# EAGLE schematic PLT-01-RevC (EAGLE 7.6.0)
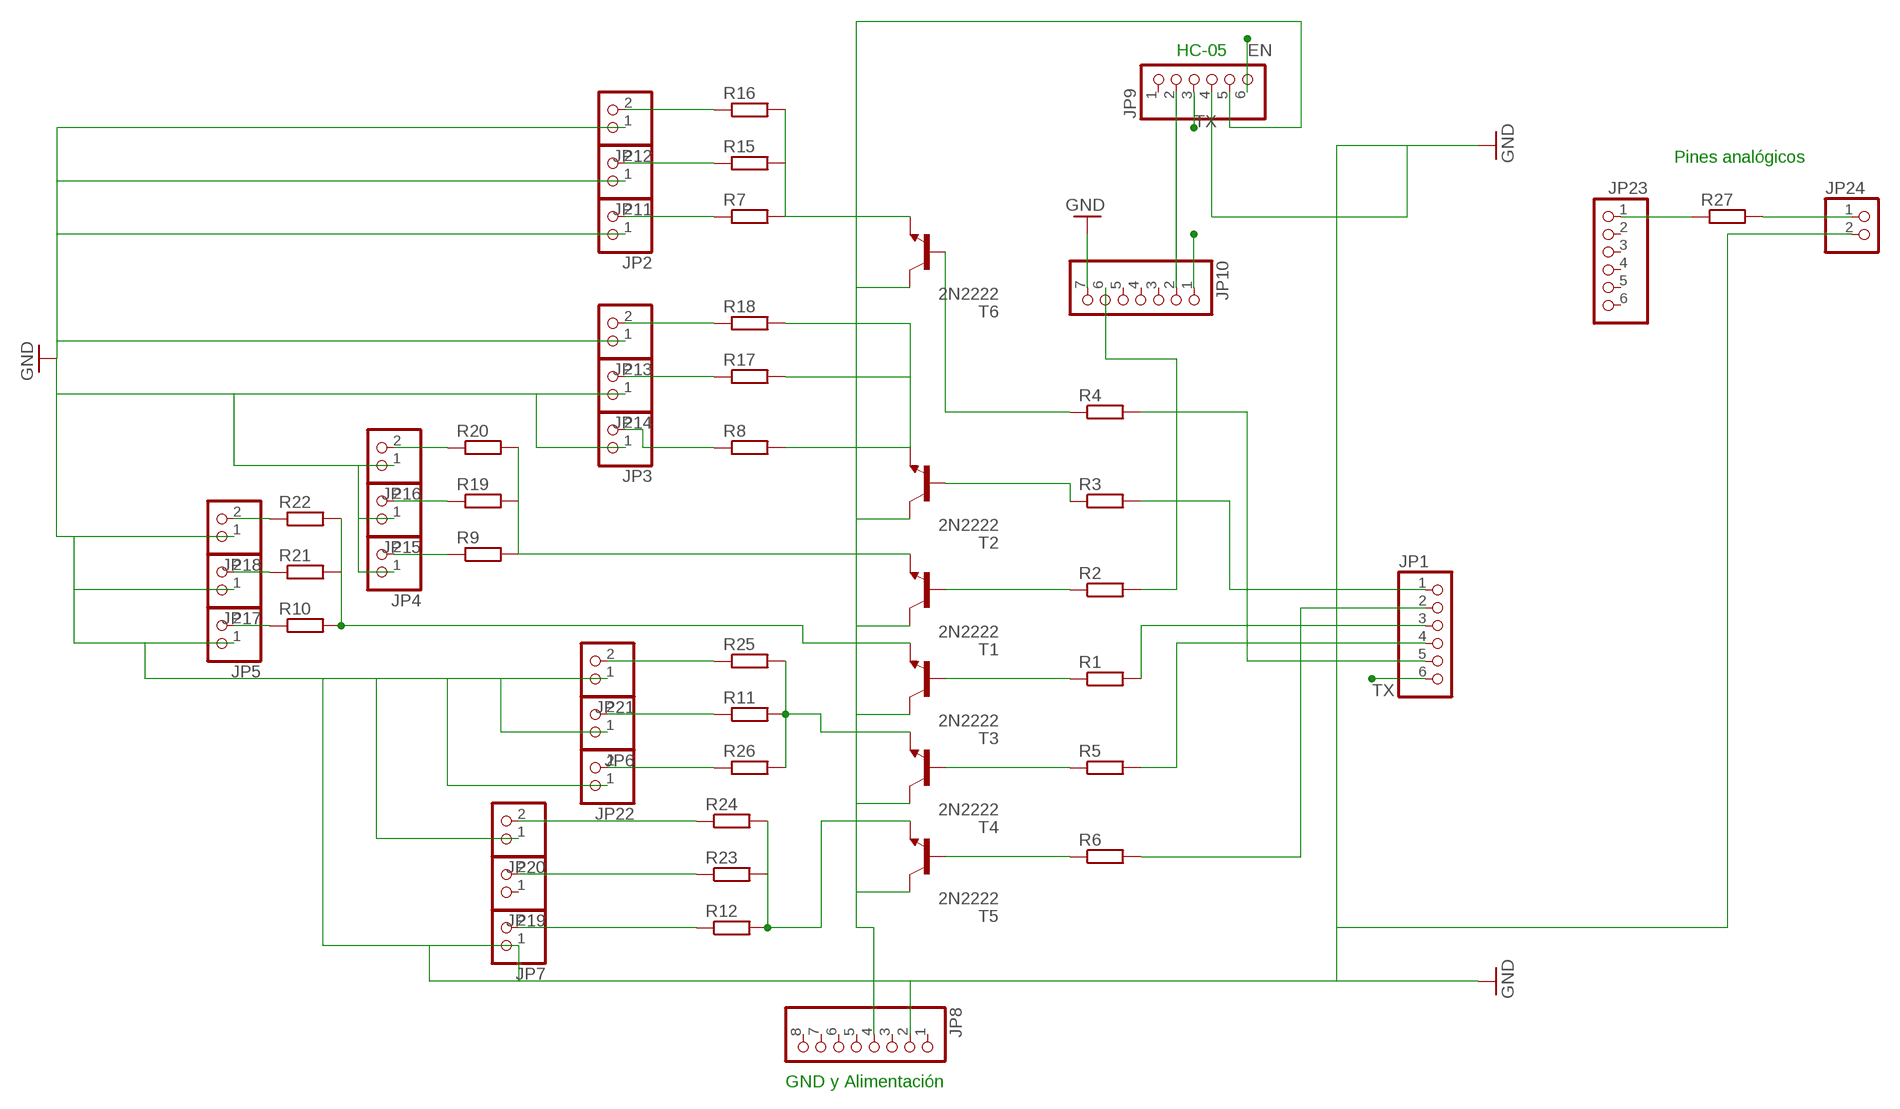
[diagram p0: schematic, sheet 1]

## Parts
JP1  PINHD-1X6  [1X06]
JP2  PINHD-1X2  [1X02]
JP3  PINHD-1X2  [1X02]
JP4  PINHD-1X2  [1X02]
JP5  PINHD-1X2  [1X02]
JP6  PINHD-1X2  [1X02]
JP7  PINHD-1X2  [1X02]
JP8  PINHD-1X8  [1X08]
JP9  PINHD-1X6  [1X06]
JP10  PINHD-1X7  [1X07]
JP11  PINHD-1X2  [1X02]
JP12  PINHD-1X2  [1X02]
JP13  PINHD-1X2  [1X02]
JP14  PINHD-1X2  [1X02]
JP15  PINHD-1X2  [1X02]
JP16  PINHD-1X2  [1X02]
JP17  PINHD-1X2  [1X02]
JP18  PINHD-1X2  [1X02]
JP19  PINHD-1X2  [1X02]
JP20  PINHD-1X2  [1X02]
JP21  PINHD-1X2  [1X02]
JP22  PINHD-1X2  [1X02]
JP23  PINHD-1X6  [1X06]
JP24  PINHD-1X2  [1X02]
R1  R-EU_0207/10  [0207/10]
R2  R-EU_0207/10  [0207/10]
R3  R-EU_0207/10  [0207/10]
R4  R-EU_0207/10  [0207/10]
R5  R-EU_0207/10  [0207/10]
R6  R-EU_0207/10  [0207/10]
R7  R-EU_0207/10  [0207/10]
R8  R-EU_0207/10  [0207/10]
R9  R-EU_0207/10  [0207/10]
R10  R-EU_0207/10  [0207/10]
R11  R-EU_0207/10  [0207/10]
R12  R-EU_0207/10  [0207/10]
R15  R-EU_0207/10  [0207/10]
R16  R-EU_0207/10  [0207/10]
R17  R-EU_0207/10  [0207/10]
R18  R-EU_0207/10  [0207/10]
R19  R-EU_0207/10  [0207/10]
R20  R-EU_0207/10  [0207/10]
R21  R-EU_0207/10  [0207/10]
R22  R-EU_0207/10  [0207/10]
R23  R-EU_0207/10  [0207/10]
R24  R-EU_0207/10  [0207/10]
R25  R-EU_0207/10  [0207/10]
R26  R-EU_0207/10  [0207/10]
R27  R-EU_0207/10  [0207/10]
T1  2N2222  [TO92-EBC-OVAL]
T2  2N2222  [TO92-EBC-OVAL]
T3  2N2222  [TO92-EBC-OVAL]
T4  2N2222  [TO92-EBC-OVAL]
T5  2N2222  [TO92-EBC-OVAL]
T6  2N2222  [TO92-EBC-OVAL]

## Nets
5V: JP8.4 JP9.5 T1.C T2.C T3.C T4.C T5.C T6.C
EN: JP9.6 JP10.1
GND: JP2.1 JP3.1 JP4.1 JP5.1 JP6.1 JP7.1 JP8.2 JP9.4 JP10.7 JP11.1 JP12.1 JP13.1 JP14.1 JP15.1 JP16.1 JP17.1 JP18.1 JP20.1 JP21.1 JP22.1 JP24.2
N$1: JP1.5 R4.2
N$2: JP1.1 R3.2
N$3: JP10.6 R2.2
N$4: JP1.3 R1.2
N$5: JP1.4 R5.2
N$7: R6.1 T5.B
N$8: R5.1 T4.B
N$9: R1.1 T3.B
N$10: R2.1 T1.B
N$11: R3.1 T2.B
N$12: R4.1 T6.B
N$13: R7.2 R15.2 R16.2 T6.E
N$14: JP2.2 R7.1
N$15: R8.2 R17.2 R18.2 T2.E
N$16: JP3.2 R8.1
N$17: R9.2 R19.2 R20.2 T1.E
N$18: JP4.2 R9.1
N$19: R10.2 R21.2 R22.2 T3.E
N$20: JP5.2 R10.1
N$21: R11.2 R25.2 R26.2 T4.E
N$22: JP6.2 R11.1
N$23: R12.2 R23.2 R24.2 T5.E
N$24: JP7.2 R12.1
N$25: JP9.2 JP10.2
N$29: JP13.2 R18.1
N$30: JP14.2 R17.1
N$31: JP17.2 R21.1
N$32: JP18.2 R22.1
N$33: JP19.2 R23.1
N$34: JP20.2 R24.1
N$35: JP21.2 R25.1
N$36: JP22.2 R26.1
N$37: JP12.2 R16.1
N$38: JP11.2 R15.1
N$39: JP16.2 R20.1
N$40: JP15.2 R19.1
N$41: JP23.1 R27.1
N$42: JP24.1 R27.2
N$44: JP1.2 R6.2
TX: JP1.6 JP9.3
Unconnected: JP8.1 JP8.3 JP8.5 JP8.6 JP8.7 JP8.8 JP9.1 JP10.3 JP10.4 JP10.5 JP19.1 JP23.2 JP23.3 JP23.4 JP23.5 JP23.6

## Notes on the sheet
- HC-05
- Pines analógicos
- GND y Alimentación

## Library data of the parts
JP1 JP9 JP23 = pinhead:PINHD-1X6: PIN HEADER
JP2-JP7 JP11-JP22 JP24 = pinhead:PINHD-1X2: PIN HEADER
JP8 = pinhead:PINHD-1X8: PIN HEADER
JP10 = pinhead:PINHD-1X7: PIN HEADER
R1-R12 R15-R27 = resistor:R-EU_: RESISTOR, European symbol
T1-T6 = adafruit:2N2222: NPN TRANSISTOR Big oval pads